# EAGLE design amp_tda1557q_v_1_0 (EAGLE 6.4)
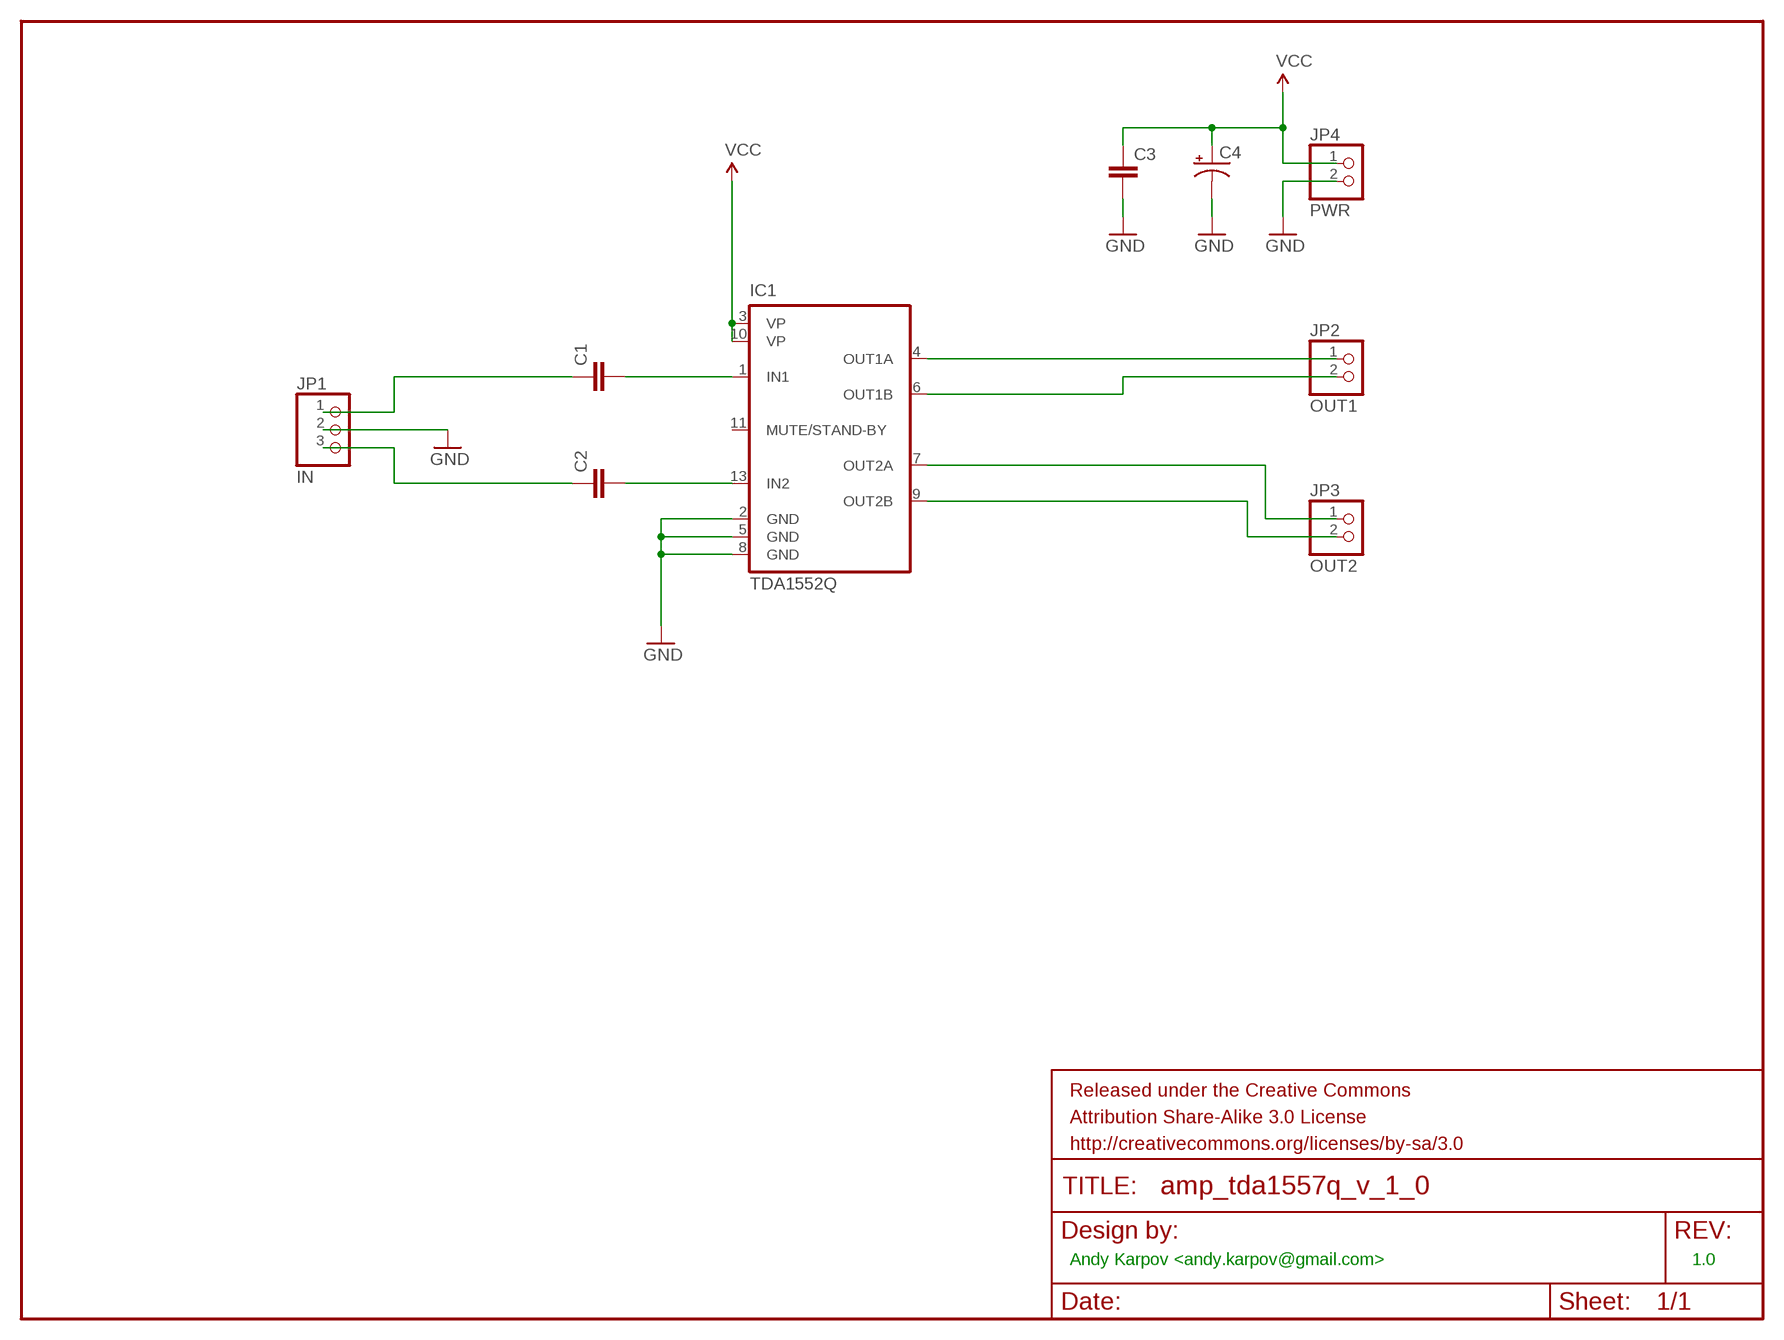
[diagram p0: schematic, sheet 1]

## Parts
C1  CAPPTH3  [CAP-PTH-LARGE]
C2  CAPPTH3  [CAP-PTH-LARGE]
C3  CAPPTH3  [CAP-PTH-LARGE]
C4  CAP_POLPTH3  [CPOL-RADIAL-1000UF-63V]
FRAME1  FRAME-LETTER  [CREATIVE_COMMONS]
IC1  TDA1552Q  [MULTIWAT-SIL13]
JP1  IN  PINHD-1X3  [1X03]
JP2  OUT1  PINHD-1X2  [1X02]
JP3  OUT2  PINHD-1X2  [1X02]
JP4  PWR  PINHD-1X2  [1X02]

## Nets
GND: C3.2 C4.2(-) IC1.2(GND) IC1.5(GND) IC1.8(GND) JP1.2 JP4.2
N$1: C1.1 JP1.1
N$2: C1.2 IC1.1(IN1)
N$3: C2.1 JP1.3
N$4: C2.2 IC1.13(IN2)
N$6: IC1.4(OUT1A) JP2.1
N$7: IC1.6(OUT1B) JP2.2
N$8: IC1.7(OUT2A) JP3.1
N$9: IC1.9(OUT2B) JP3.2
VCC: C3.1 C4.1(+) IC1.3(VP) IC1.10(VP) JP4.1
Unconnected: IC1.11(MUTE/STAND-BY)

## Notes on the sheet
- Andy Karpov <andy.karpov@gmail.com> | 1.0

## Library data of the parts
C1-C3 = SparkFun-Capacitors:CAP: Capacitor Standard 0603 ceramic capacitor, and 0.1" leaded capacitor.
C4 = SparkFun-Capacitors:CAP_POL: Capacitor Polarized These are standard SMD and PTH capacitors. Normally 10uF, 47uF, and 100uF in electrolytic and tantalum varieties. Always verify the external diameter of the through hole cap, it varies with capacity, voltage, and manufacturer. The EIA devices should be standard.
FRAME1 = SparkFun-Aesthetics:FRAME-LETTER: Schematic Frame Standard 8.5x11 US Letter frame
IC1 = philips-semiconductors:TDA1552Q: 2 x 22 W BTL stereo car radio power amplifier Source: Data sheet <http://www.nxp.com/documents/data_sheet/TDA1552Q_CNV.pdf>
JP1 = pinhead:PINHD-1X3: PIN HEADER
JP2-JP4 = pinhead:PINHD-1X2: PIN HEADER

## Board
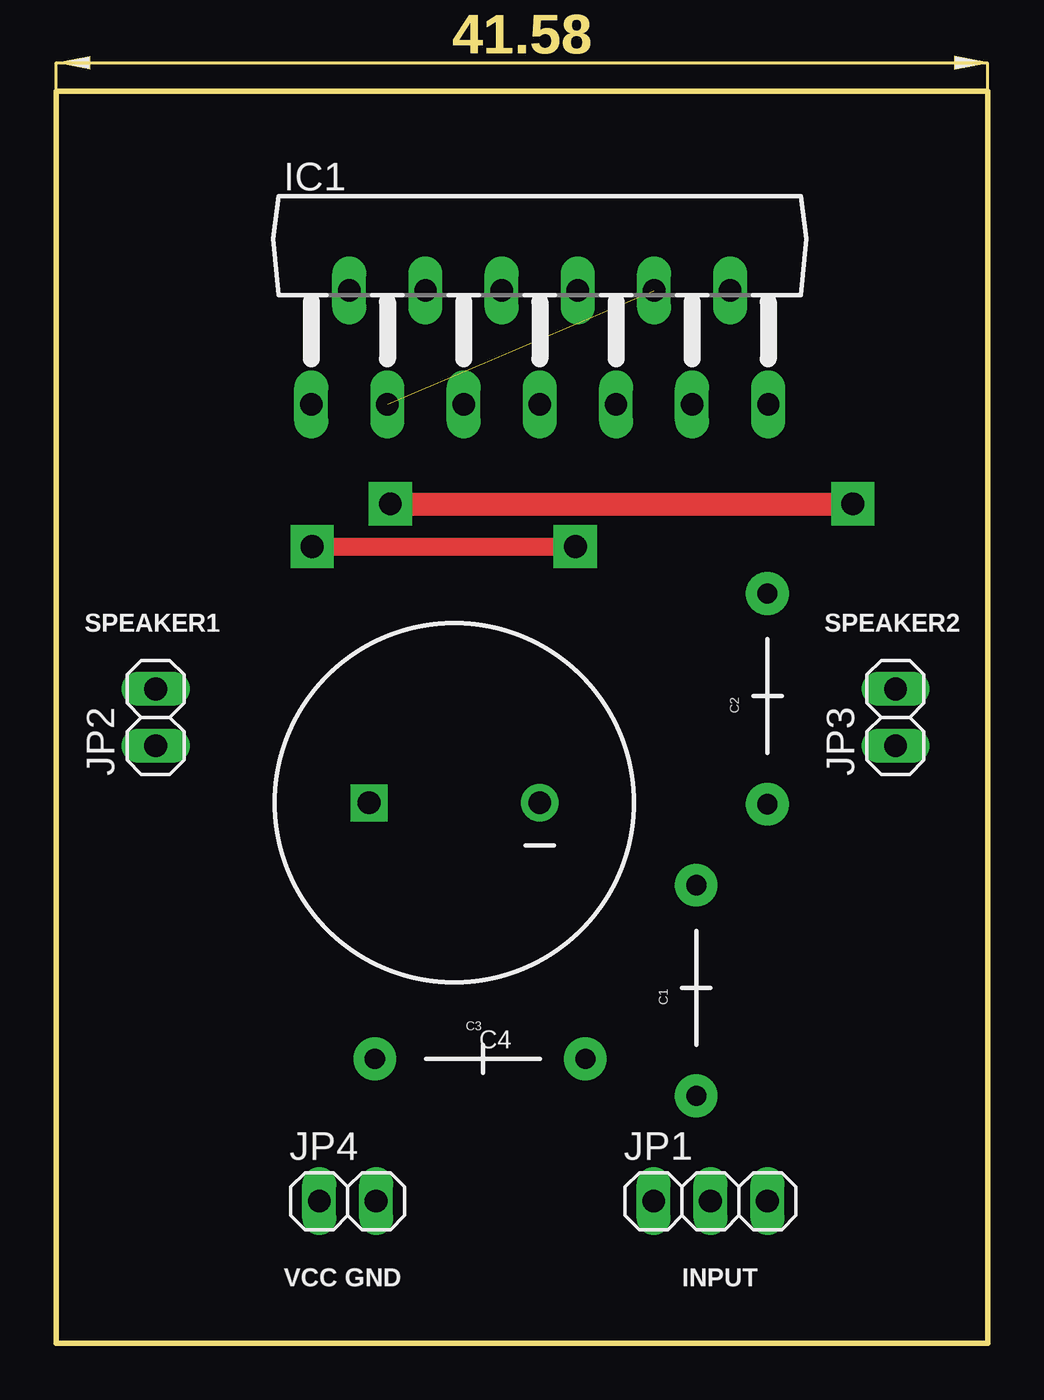
[diagram p1: board, top side]
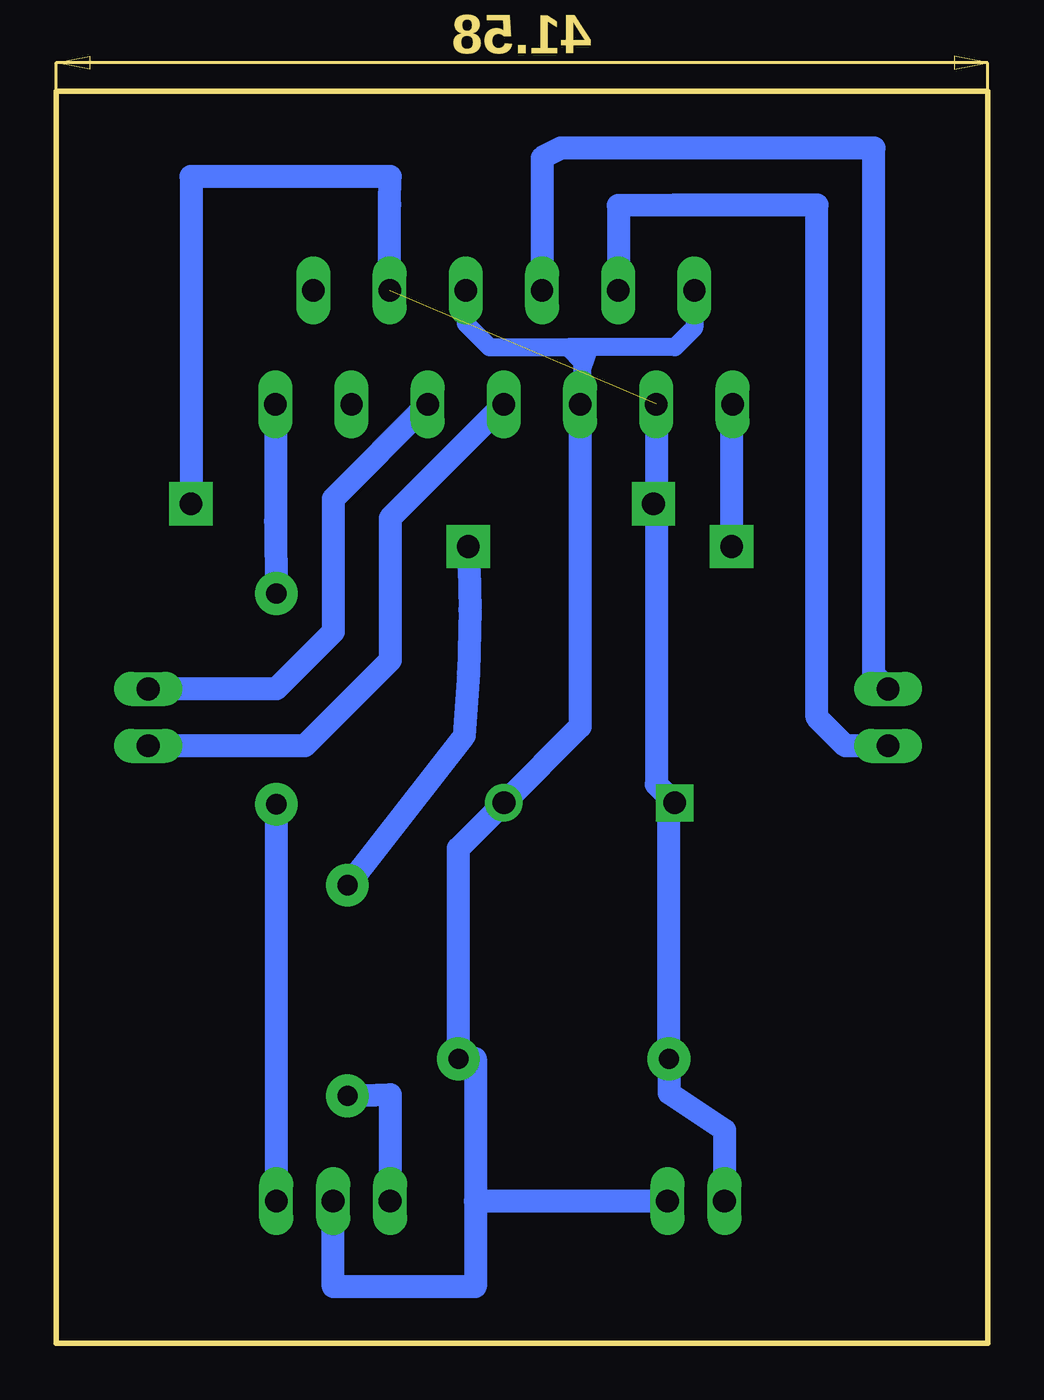
[diagram p2: board, bottom side, seen from below]

Size 41.58 x 55.87 mm. Coordinates in mm from the lower left corner, seen from the top.
Outline: 0,0 41.58,0 41.58,55.87 0,55.87 0,0
Copper layers (1*16): Top 0.035mm / dielectric 1.5mm / Bottom 0.035mm
Design rules "default": minimum track width 10mil, minimum drill 24mil, track to track 8mil, track to pad 8mil, pad to pad 8mil, via to via 8mil, smd to smd 8mil, copper to edge 40mil, drill to drill 8mil, minimum pad ring 10mil, minimum via ring 8mil, stop-mask expansion 4mil, vias tented up to drill 0mil, thermal gap 10mil

### Footprints (pad centres in the part's own frame; a part is rotated, then mirrored left to right if it is on the bottom)
CAP-PTH-LARGE = drill 0.9 pad 1.905: 1 -4.826,0; 2 4.572,0
CPOL-RADIAL-1000UF-63V = drill 1.016 pad 1.651 square: 1 3.81,0 | drill 1.016 pad 1.676: 2 -3.81,0
MULTIWAT-SIL13 = drill 1 pad 1.5 long: 1 -10.2,-5.08; 2 -8.5,0; 3 -6.8,-5.08; 4 -5.1,0; 5 -3.4,-5.08; 6 -1.7,0; 7 0,-5.08; 8 1.7,0; 9 3.4,-5.08; 10 5.1,0; 11 6.8,-5.08; 12 8.5,0; 13 10.2,-5.08
1X03 = drill 1.016 long: 1 -2.54,0; 2 0,0; 3 2.54,0
1X02 = drill 1.016 long: 1 -1.27,0; 2 1.27,0

### Placement (x,y rotation side)
C1  28.57,15.88 90 top
C2  31.75,28.89 90 top
C3  19.05,12.7 0 top
C4  17.78,24.13 180 top
FRAME1  0,60.96 0 top  (outside the outline)
IC1  21.59,46.99 0 top
JP1  29.21,6.35 0 top
JP2  4.45,27.94 90 top
JP3  37.47,27.94 90 top
JP4  13.02,6.35 0 top

### Tracks (layer width: path | path; a pad name or v marks a point on that pad's centre or on a via)
GND
  Bottom 0.813: IC1.2 13.09,45.33 13.97,44.45 17.78,44.45 | 17.78,44.45 18.73,44.45 | 18.73,44.45 18.1,43.81 18.1,43.5 | 18.1,43.5 18.1,42 IC1.5 | IC1.8 23.29,45.52 22.23,44.45 18.73,44.45 | 17.78,44.45 18.1,43.5
  Bottom 1.016: 22.86,6.35 22.86,12.7 C3.2 23.62,22.1 C4.2 18.19,27.53 IC1.5 | JP4.2 22.86,6.35 | 22.86,6.35 22.86,2.54 29.21,2.54 JP1.2
N$1
  Bottom 1.016: C1.1 26.67,11.11 JP1.1
N$2  (via drill 1.02 pad 1.93)
  Top 0.813: v11.43,35.56 v23.18,35.56
  Bottom 0.813: IC1.1 11.43,41.87
  Bottom 1.016: 11.43,41.87 v11.43,35.56 | v23.18,35.56 arc8 23.37,27.11 C1.2
N$3
  Bottom 1.016: C2.1 JP1.3
N$4
  Bottom 1.016: IC1.13 31.79,36.68 C2.2
N$5  (via drill 1.02 pad 1.93)
  Top 1.016: v14.92,37.47 v35.56,37.47
N$6
  Bottom 1.016: JP2.1 6.35,26.67 7.62,27.94 7.62,50.8 13.97,50.8 16.49,50.78 IC1.4
N$7
  Bottom 1.016: JP2.2 5.08,29.84 5.08,53.34 19.05,53.34 19.89,52.91 IC1.6
N$8
  Bottom 1.016: IC1.7 26.67,36.83 26.67,30.48 30.48,26.67 JP3.1
N$9
  Bottom 1.016: IC1.9 29.21,37.69 29.21,31.75 31.75,29.21 JP3.2
VCC  (1 unrouted)
  Bottom 1.016: JP4.1 11.75,9.53 14.22,11.18 C3.1 14.22,23.88 C4.1 14.79,24.95 IC1.3 | IC1.10 26.69,50.82 26.67,52.07 35.56,52.07 35.56,37.47

### Text on the board
tNames: SPEAKER1 | SPEAKER2 | VCC GND | INPUT